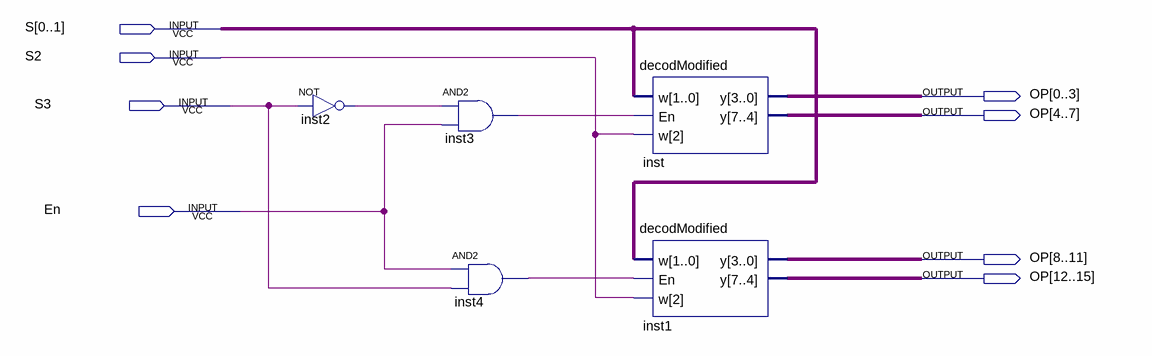
[diagram p0: schematic sheet]
// Quartus schematic decoder.bdf as structural Verilog: 5 symbols, 8 pins
module decoder (
  input  [0:1] S,
  input  S2,
  input  S3,
  input  En,
  output [0:15] OP
);

  wire inst2_out, inst3_out, inst4_out;

  not inst2 (inst2_out, S3);
  and inst3 (inst3_out, inst2_out, En);
  and inst4 (inst4_out, En, S3);
  decodModified inst (.w({S2, S}), .En(inst3_out), .y({OP[4:7], OP[0:3]}));
  decodModified inst1 (.w({S2, S}), .En(inst4_out), .y({OP[12:15], OP[8:11]}));
endmodule
